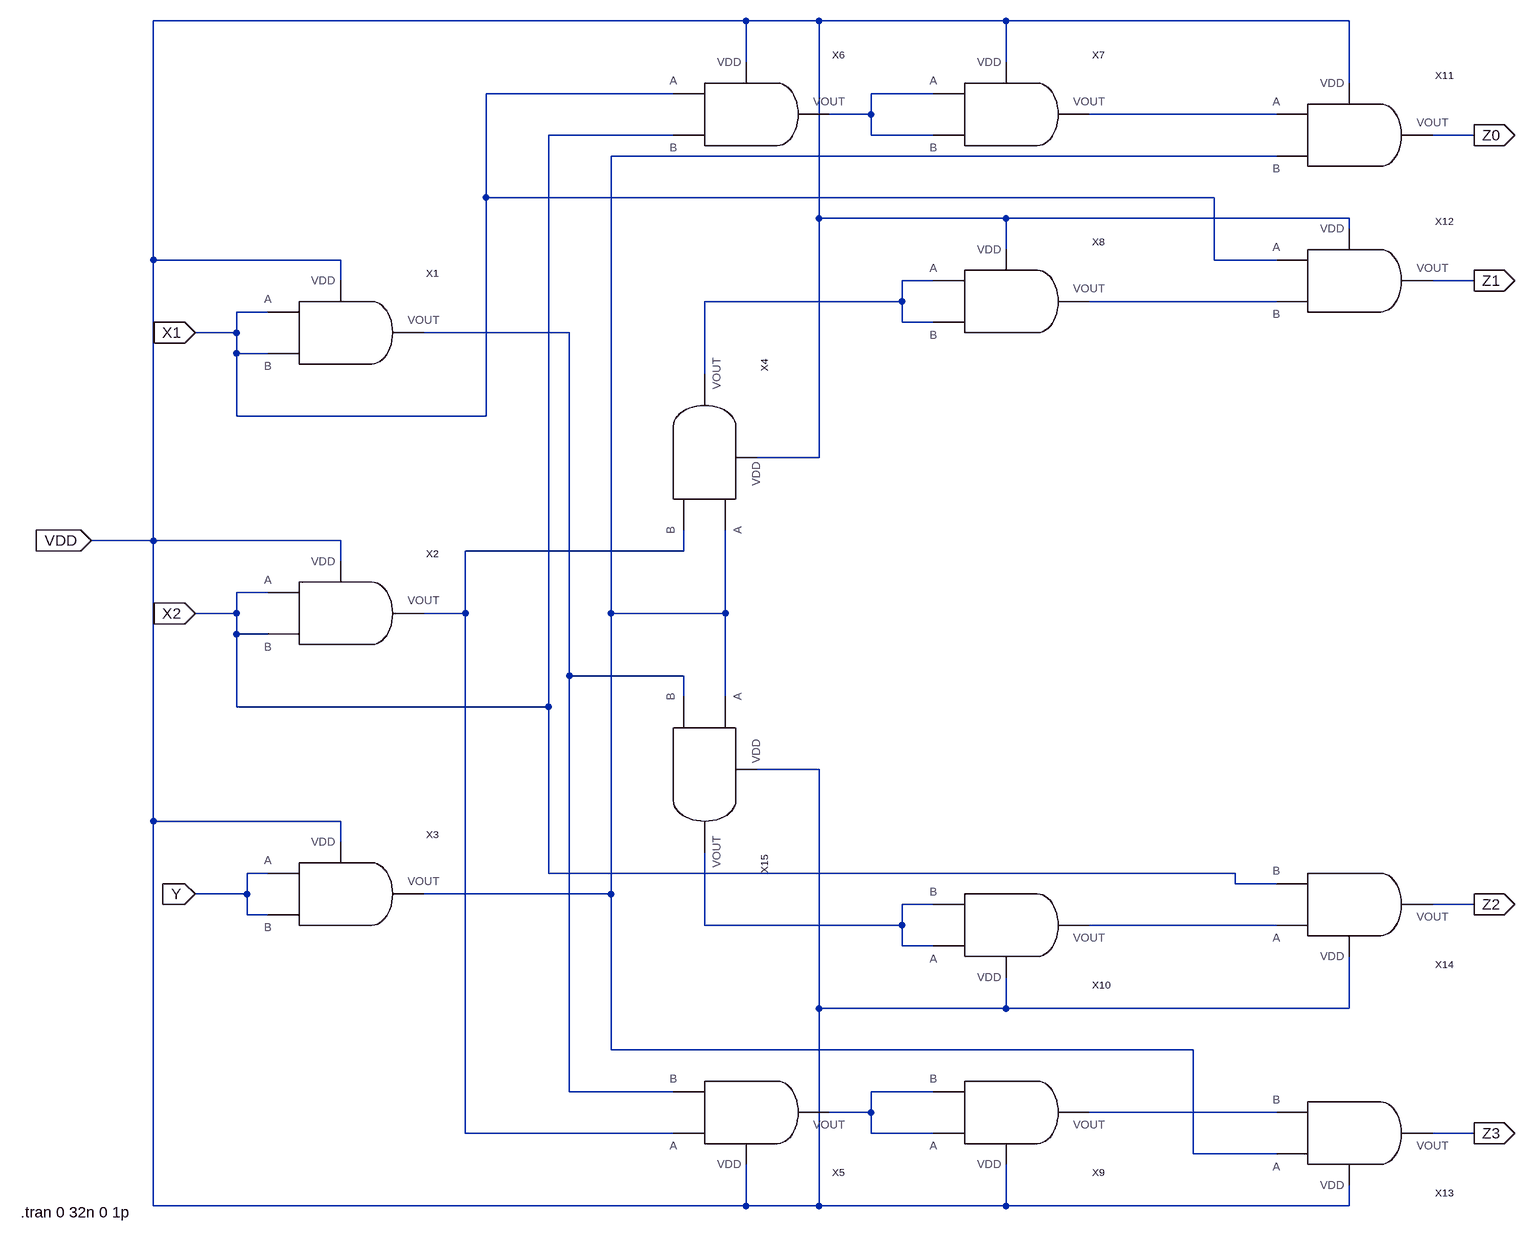
[diagram p0: schematic BOE.asc]
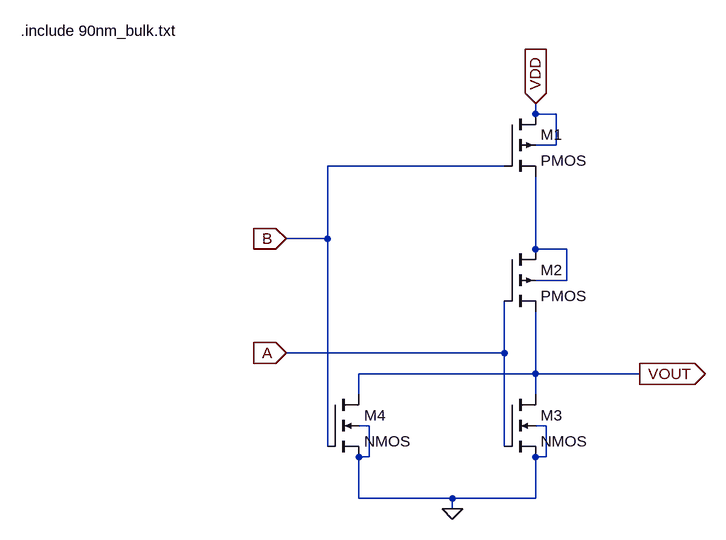
[diagram p1: sub-circuit nor.asc]
BOE.asc, the LTspice schematic file:
Version 4
SHEET 1 1588 1164
WIRE 336 -688 -576 -688
WIRE 448 -688 336 -688
WIRE 736 -688 448 -688
WIRE 1264 -688 736 -688
WIRE 336 -624 336 -688
WIRE 736 -624 736 -688
WIRE 1264 -592 1264 -688
WIRE 224 -576 -64 -576
WIRE 624 -576 528 -576
WIRE 528 -544 528 -576
WIRE 528 -544 464 -544
WIRE 1152 -544 864 -544
WIRE 224 -512 32 -512
WIRE 528 -512 528 -544
WIRE 624 -512 528 -512
WIRE 1456 -512 1392 -512
WIRE 1152 -480 128 -480
WIRE -64 -416 -64 -576
WIRE 1056 -416 -64 -416
WIRE 448 -384 448 -688
WIRE 736 -384 448 -384
WIRE 1264 -384 736 -384
WIRE 1264 -368 1264 -384
WIRE 736 -336 736 -384
WIRE -576 -320 -576 -688
WIRE -288 -320 -576 -320
WIRE 1056 -320 1056 -416
WIRE 1152 -320 1056 -320
WIRE -288 -288 -288 -320
WIRE 624 -288 576 -288
WIRE 1456 -288 1392 -288
WIRE 576 -256 576 -288
WIRE 576 -256 272 -256
WIRE 1152 -256 864 -256
WIRE -400 -240 -448 -240
WIRE 576 -224 576 -256
WIRE 624 -224 576 -224
WIRE -448 -208 -448 -240
WIRE -448 -208 -512 -208
WIRE 64 -208 -160 -208
WIRE -448 -176 -448 -208
WIRE -400 -176 -448 -176
WIRE 272 -144 272 -256
WIRE -448 -80 -448 -176
WIRE -64 -80 -64 -416
WIRE -64 -80 -448 -80
WIRE 448 -16 448 -384
WIRE 448 -16 352 -16
WIRE -576 112 -576 -320
WIRE -576 112 -672 112
WIRE -288 112 -576 112
WIRE 240 128 240 96
WIRE 240 128 -96 128
WIRE -288 144 -288 112
WIRE -400 192 -448 192
WIRE -448 224 -448 192
WIRE -448 224 -512 224
WIRE -96 224 -96 128
WIRE -96 224 -160 224
WIRE 128 224 128 -480
WIRE 304 224 304 96
WIRE 304 224 128 224
WIRE -448 256 -448 224
WIRE -400 256 -448 256
WIRE 64 320 64 -208
WIRE 240 320 64 320
WIRE 240 352 240 320
WIRE 304 352 304 224
WIRE -448 368 -448 256
WIRE 32 368 32 -512
WIRE 32 368 -448 368
WIRE 448 464 352 464
WIRE -576 544 -576 112
WIRE -288 544 -576 544
WIRE -288 576 -288 544
WIRE -400 624 -432 624
WIRE 32 624 32 368
WIRE 1088 624 32 624
WIRE 1088 640 1088 624
WIRE 1152 640 1088 640
WIRE -432 656 -432 624
WIRE -432 656 -512 656
WIRE 128 656 128 224
WIRE 128 656 -160 656
WIRE 624 672 576 672
WIRE 1456 672 1392 672
WIRE -432 688 -432 656
WIRE -400 688 -432 688
WIRE 272 704 272 592
WIRE 576 704 576 672
WIRE 576 704 272 704
WIRE 1152 704 864 704
WIRE 576 736 576 704
WIRE 624 736 576 736
WIRE 448 832 448 464
WIRE 736 832 736 784
WIRE 736 832 448 832
WIRE 1264 832 1264 752
WIRE 1264 832 736 832
WIRE 128 896 128 656
WIRE 1024 896 128 896
WIRE 64 960 64 320
WIRE 224 960 64 960
WIRE 624 960 528 960
WIRE 528 992 528 960
WIRE 528 992 464 992
WIRE 1152 992 864 992
WIRE -96 1024 -96 224
WIRE 224 1024 -96 1024
WIRE 528 1024 528 992
WIRE 624 1024 528 1024
WIRE 1456 1024 1392 1024
WIRE 1024 1056 1024 896
WIRE 1152 1056 1024 1056
WIRE -576 1136 -576 544
WIRE 336 1136 336 1072
WIRE 336 1136 -576 1136
WIRE 448 1136 448 832
WIRE 448 1136 336 1136
WIRE 736 1136 736 1072
WIRE 736 1136 448 1136
WIRE 1264 1136 1264 1104
WIRE 1264 1136 736 1136
FLAG -672 112 VDD
IOPIN -672 112 In
FLAG -512 -208 X1
IOPIN -512 -208 In
FLAG -512 224 X2
IOPIN -512 224 In
FLAG -512 656 Y
IOPIN -512 656 In
FLAG 1456 -512 Z0
IOPIN 1456 -512 Out
FLAG 1456 -288 Z1
IOPIN 1456 -288 Out
FLAG 1456 672 Z2
IOPIN 1456 672 Out
FLAG 1456 1024 Z3
IOPIN 1456 1024 Out
SYMBOL NOR -288 -208 R0
SYMATTR InstName X1
SYMBOL NOR -288 224 R0
SYMATTR InstName X2
SYMBOL NOR -288 656 R0
SYMATTR InstName X3
SYMBOL NOR 336 -544 R0
SYMATTR InstName X6
SYMBOL NOR 736 -544 R0
SYMATTR InstName X7
SYMBOL NOR 736 -256 R0
SYMATTR InstName X8
SYMBOL NOR 1264 -512 R0
SYMATTR InstName X11
SYMBOL NOR 1264 -288 R0
SYMATTR InstName X12
SYMBOL NOR 272 -16 M270
SYMATTR InstName X4
SYMBOL NOR 336 992 M180
SYMATTR InstName X5
SYMBOL NOR 736 992 M180
SYMATTR InstName X9
SYMBOL NOR 736 704 M180
SYMATTR InstName X10
SYMBOL NOR 1264 1024 M180
SYMATTR InstName X13
SYMBOL NOR 1264 672 M180
SYMATTR InstName X14
SYMBOL NOR 272 464 R90
SYMATTR InstName X15
TEXT -780 1146 Left 2 !.tran 0 32n 0 1p

nor.asc, the sub-circuit schematic file:
Version 4
SHEET 1 880 680
WIRE -11568 -3200 -11568 -3216
WIRE -11536 -3200 -11568 -3200
WIRE -11536 -3152 -11536 -3200
WIRE -11536 -3152 -11568 -3152
WIRE -11616 -3120 -11888 -3120
WIRE -11888 -3008 -11888 -3120
WIRE -11888 -3008 -11952 -3008
WIRE -11568 -2992 -11568 -3104
WIRE -11520 -2992 -11568 -2992
WIRE -11520 -2944 -11520 -2992
WIRE -11520 -2944 -11568 -2944
WIRE -11616 -2832 -11616 -2912
WIRE -11616 -2832 -11952 -2832
WIRE -11568 -2800 -11568 -2896
WIRE -11568 -2800 -11840 -2800
WIRE -11408 -2800 -11568 -2800
WIRE -11840 -2768 -11840 -2800
WIRE -11568 -2768 -11568 -2800
WIRE -11824 -2720 -11840 -2720
WIRE -11552 -2720 -11568 -2720
WIRE -11888 -2688 -11888 -3008
WIRE -11616 -2688 -11616 -2832
WIRE -11824 -2672 -11824 -2720
WIRE -11824 -2672 -11840 -2672
WIRE -11552 -2672 -11552 -2720
WIRE -11552 -2672 -11568 -2672
WIRE -11840 -2608 -11840 -2672
WIRE -11696 -2608 -11840 -2608
WIRE -11568 -2608 -11568 -2672
WIRE -11568 -2608 -11696 -2608
WIRE -11696 -2592 -11696 -2608
FLAG -11696 -2592 0
FLAG -11408 -2800 VOUT
IOPIN -11408 -2800 Out
FLAG -11952 -2832 A
IOPIN -11952 -2832 In
FLAG -11952 -3008 B
IOPIN -11952 -3008 In
FLAG -11568 -3216 VDD
IOPIN -11568 -3216 In
SYMBOL pmos4 -11616 -3200 R0
SYMATTR InstName M1
SYMATTR Value2 l=90n w=400n
SYMBOL pmos4 -11616 -2992 R0
SYMATTR InstName M2
SYMATTR Value2 l=90n w=400n
SYMBOL nmos4 -11616 -2768 R0
SYMATTR InstName M3
SYMATTR Value2 l=90n w=200n
SYMBOL nmos4 -11888 -2768 R0
SYMATTR InstName M4
SYMATTR Value2 l=90n w=200n
TEXT -12360 -3328 Left 2 !.include 90nm_bulk.txt

The netlist it stands for:
* BOE.asc
XX1 X1 X1 VDD N006 nor
XX2 X2 X2 VDD N007 nor
XX3 Y Y VDD N003 nor
XX6 X1 X2 VDD N001 nor
XX7 N001 N001 VDD N002 nor
XX8 N004 N004 VDD N005 nor
XX11 N002 N003 VDD Z0 nor
XX12 X1 N005 VDD Z1 nor
XX4 N003 N007 VDD N004 nor
XX5 N007 N006 VDD N010 nor
XX9 N010 N010 VDD N011 nor
XX10 N008 N008 VDD N009 nor
XX13 N003 N011 VDD Z3 nor
XX14 N009 X2 VDD Z2 nor
XX15 N003 N006 VDD N008 nor

* block symbol definitions
.subckt nor A B VDD VOUT
M1 VDD B N001 VDD PMOS l=90n w=400n
M2 N001 A VOUT N001 PMOS l=90n w=400n
M3 VOUT A 0 0 NMOS l=90n w=200n
M4 VOUT B 0 0 NMOS l=90n w=200n
.include 90nm_bulk.txt
.ends nor

.model NMOS NMOS
.model PMOS PMOS
.lib standard.mos
.tran 0 32n 0 1p
.backanno
.end